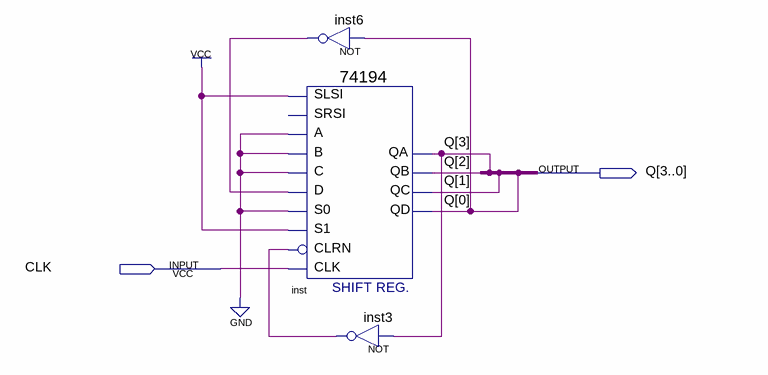
[diagram p0: schematic sheet]
// Quartus schematic ii.bdf as structural Verilog: 3 symbols, 2 pins
module ii (
  input  CLK,
  output [3:0] Q
);

  wire inst3_out, inst6_out;

  not inst6 (inst6_out, Q[0]);
  \74194  inst (
    .SLSI(1'b1), .B(1'b0), .C(1'b0), .CLK(CLK), .CLRN(inst3_out), .D(inst6_out), .S1(1'b1), .S0(1'b0),
    .A(1'b0), .QA(Q[3]), .QB(Q[2]), .QC(Q[1]), .QD(Q[0]));  // open: SRSI
  not inst3 (inst3_out, Q[3]);
endmodule
